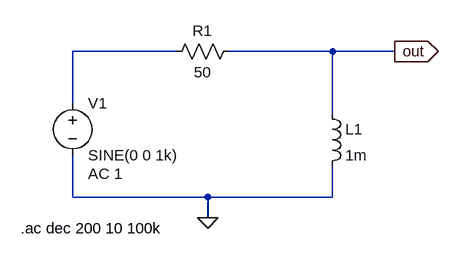
[diagram p0: schematic Part.asc]
Part.asc, the LTspice schematic file:
Version 4.1
SHEET 1 880 680
WIRE 256 32 96 32
WIRE 496 32 336 32
WIRE 592 32 496 32
WIRE 96 112 96 32
WIRE 496 128 496 32
WIRE 96 256 96 192
WIRE 304 256 96 256
WIRE 496 256 496 208
WIRE 496 256 304 256
WIRE 304 288 304 256
FLAG 304 288 0
FLAG 592 32 out
IOPIN 592 32 Out
SYMBOL voltage 96 96 R0
WINDOW 123 24 124 Left 2
WINDOW 39 0 0 Left 0
SYMATTR InstName V1
SYMATTR Value SINE(0 0 1k)
SYMATTR Value2 AC 1
SYMBOL res 352 16 R90
WINDOW 0 0 56 VBottom 2
WINDOW 3 32 56 VTop 2
SYMATTR InstName R1
SYMATTR Value 50
SYMBOL ind 480 112 R0
SYMATTR InstName L1
SYMATTR Value 1m
TEXT 16 304 Left 2 !.ac dec 200 10 100k

The netlist it stands for:
* Part.asc
V1 N001 0 SINE(0 0 1k) AC 1
R1 out N001 50
L1 out 0 1m
.ac dec 200 10 100k
.backanno
.end